# EAGLE design Esquema elètric (EAGLE 7.4.0)
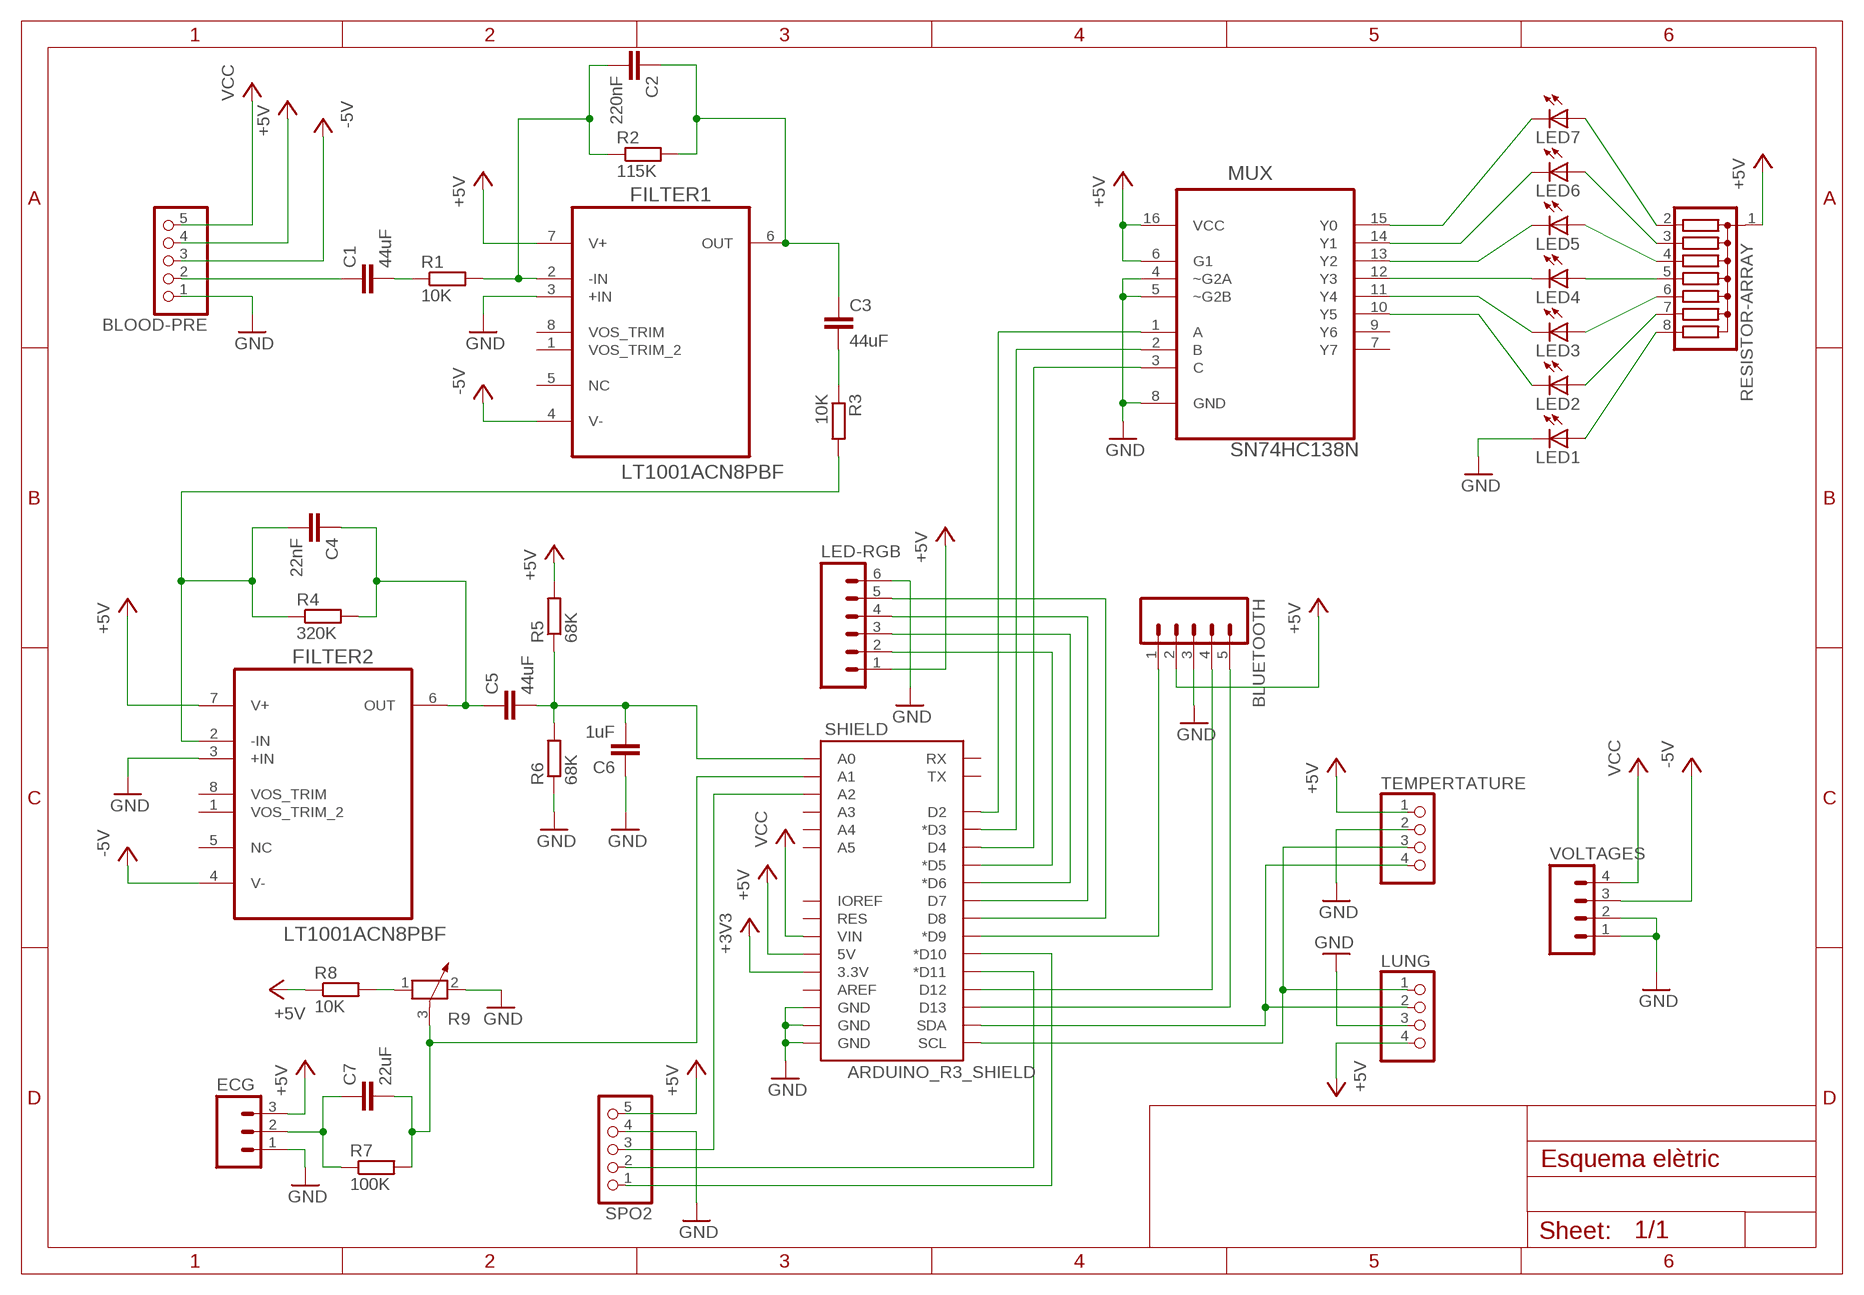
[diagram p0: schematic, sheet 1]

## Parts
BLOOD-PRE  PINHD-1X5  [1X05]
BLUETOOTH  M05PTH  [1X05]
C1  44uF  C-EU050-050X075  [C050-050X075]
C2  220nF  C-EU050-024X044  [C050-024X044]
C3  44uF  C-EU050-050X075  [C050-050X075]
C4  22nF  C-EU050-024X044  [C050-024X044]
C5  44uF  C-EU050-050X075  [C050-050X075]
C6  1uF  C-EU050-050X075  [C050-050X075]
C7  22uF  C-EU050-050X075  [C050-050X075]
ECG  M03PTH  [1X03]
FILTER1  LT1001ACN8PBF  [DIP254P762X393-8]
FILTER2  LT1001ACN8PBF  [DIP254P762X393-8]
LED1  LED5MM  [LED5MM]
LED2  LED5MM  [LED5MM]
LED3  LED5MM  [LED5MM]
LED4  LED5MM  [LED5MM]
LED5  LED5MM  [LED5MM]
LED6  LED5MM  [LED5MM]
LED7  LED5MM  [LED5MM]
LED-RGB  M06SILK_FEMALE_PTH  [1X06]
LUNG  PINHD-1X4  [1X04]
MUX  SN74HC138N  [DIP254P762X508-16]
R1  10K  R0204/7  [0204/7]
R2  115K  R0204/7  [0204/7]
R3  10K  R0204/7  [0204/7]
R4  320K  R0204/7  [0204/7]
R5  68K  R0204/7  [0204/7]
R6  68K  R0204/7  [0204/7]
R7  100K  R0204/7  [0204/7]
R8  10K  R0204/7  [0204/7]
R9  POTENTIOMETER_PT-10  [PT-10]
RESISTOR-ARRAY  G07R  [SIL8]
SHIELD  ARDUINO_R3_SHIELD  [UNO_R3_SHIELD]
SPO2  PINHD-1X5  [1X05]
TEMPERTATURE  PINHD-1X4  [1X04]
VOLTAGES  M04JST  [1X04-1.5MM_JST]

## Nets
+3V3: SHIELD.3.3V
+5V [supply]: BLOOD-PRE.4 BLUETOOTH.2 ECG.3 FILTER1.7(V+) FILTER2.7(V+) LED-RGB.1 LUNG.4 MUX.6(G1) MUX.16(VCC) R5.2 R8.1 RESISTOR-ARRAY.1 SHIELD.5V SPO2.5 TEMPERTATURE.1
-5V: BLOOD-PRE.3 FILTER1.4(V-) FILTER2.4(V-) VOLTAGES.3
GND: BLOOD-PRE.1 BLUETOOTH.3 C6.1 ECG.1 FILTER1.3(+IN) FILTER2.3(+IN) LED1.K(C) LED-RGB.6 LUNG.3 MUX.4(~G2A) MUX.5(~G2B) MUX.8(GND) R6.1 R9.2 SHIELD.GND@0(GND) SHIELD.GND@1(GND) SHIELD.GND@2(GND) SPO2.4 TEMPERTATURE.2 VOLTAGES.1 VOLTAGES.2
N$1: LED7.K(C) MUX.15(Y0)
N$2: BLOOD-PRE.2 C1.1
N$3: LED6.K(C) MUX.14(Y1)
N$4: LED-RGB.2 SHIELD.D5(*D5)
N$5: LED5.K(C) MUX.13(Y2)
N$6: LED3.K(C) MUX.11(Y4)
N$7: BLUETOOTH.4 SHIELD.D12
N$8: LUNG.2 SHIELD.SDA TEMPERTATURE.4
N$9: MUX.1(A) SHIELD.D2
N$10: LED4.K(C) MUX.12(Y3)
N$11: LED2.K(C) MUX.10(Y5)
N$12: LED7.A RESISTOR-ARRAY.2
N$13: C7.1 ECG.2 R7.1
N$14: LED6.A RESISTOR-ARRAY.3
N$15: BLUETOOTH.5 SHIELD.D13
N$16: LED-RGB.5 SHIELD.D8
N$17: LED5.A RESISTOR-ARRAY.4
N$18: LED4.A RESISTOR-ARRAY.5
N$19: C7.2 R7.2 R9.3 SHIELD.A1
N$20: LED3.A RESISTOR-ARRAY.6
N$21: LED2.A RESISTOR-ARRAY.7
N$22: LED1.A RESISTOR-ARRAY.8
N$23: C4.1 C5.1 FILTER2.6(OUT) R4.2
N$24: BLUETOOTH.1 SHIELD.D9(*D9)
N$25: LED-RGB.4 SHIELD.D7
N$26: R8.2 R9.1
N$27: MUX.2(B) SHIELD.D3(*D3)
N$28: MUX.3(C) SHIELD.D4
N$29: C4.2 FILTER2.2(-IN) R3.2 R4.1
N$30: C2.1 C3.1 FILTER1.6(OUT) R2.2
N$31: C3.2 R3.1
N$32: C2.2 FILTER1.2(-IN) R1.2 R2.1
N$33: C1.2 R1.1
N$34: C5.2 C6.2 R5.1 R6.2 SHIELD.A0
N$36: LUNG.1 SHIELD.SCL TEMPERTATURE.3
N$37: SHIELD.A2 SPO2.3
N$38: SHIELD.D11(*D11) SPO2.2
N$40: LED-RGB.3 SHIELD.D6(*D6)
N$41: SHIELD.D10(*D10) SPO2.1
VCC [supply]: BLOOD-PRE.5 SHIELD.VIN VOLTAGES.4
Unconnected: FILTER1.1(VOS_TRIM_2) FILTER1.5(NC) FILTER1.8(VOS_TRIM) FILTER2.1(VOS_TRIM_2) FILTER2.5(NC) FILTER2.8(VOS_TRIM) MUX.7(Y7) MUX.9(Y6) SHIELD.A3 SHIELD.A4 SHIELD.A5 SHIELD.AREF SHIELD.IOREF SHIELD.RES SHIELD.RX SHIELD.TX

## Library data of the parts
BLOOD-PRE SPO2 = pinhead:PINHD-1X5: PIN HEADER
BLUETOOTH = SparkFun-Connectors:M05: Header 5 Standard 5-pin 0.1" header. Use with straight break away headers (SKU : PRT-00116), right angle break away headers (PRT-00553), swiss pins (PRT-00743), machine pins (PRT-00117), and female headers (PRT-00115). Molex polarized connector foot print use with SKU : PRT-08230 with associated crimp pins and housings.
C1-C7 = rcl:C-EU: CAPACITOR, European symbol
ECG = SparkFun-Connectors:M03: Header 3 Standard 3-pin 0.1" header. Use with straight break away headers (SKU : PRT-00116), right angle break away headers (PRT-00553), swiss pins (PRT-00743), machine pins (PRT-00117), and female headers (PRT-00115). Molex polarized connector foot print use with SKU : PRT-08232 with associated crimp pins and housings.
FILTER1 FILTER2 = LTC_By_element14_Batch_1:LT1001ACN8PBF: Operational Amplifier; MPN: LT1001ACN8#PBF; OC_FARNELL: 1556419; OC_NEWARK: 57M0678; PACKAGE: PDIP; SUPPLIER: LINEAR TECHNOLOGY
LED1-LED7 = led:LED: LED OSRAM: - CHIPLED LG R971, LG N971, LY N971, LG Q971, LY Q971, LO R971, LY R971 LH N974, LH R974 LS Q976, LO Q976, LY Q976 LO Q996 - Hyper CHIPLED LW Q18S LB Q993, LB Q99A, LB R99A - SideLED LS A670, LO A670, LY A670, LG A670, LP A670 LB A673, LV A673, LT A673, LW A673 LH A674 LY A675 LS A676, LA A676, LO A676, LY A676, LW A676 LS A679, LY A679, LG A679 - Hyper Micro SIDELED® LS Y876, LA Y876, LO Y876, LY Y876 LT Y87S - SmartLED LW L88C, LW L88S LB L89C, LB L89S, LG L890 LS L89K, LO L89K, LY L89K LS L896, LA L896, LO L896, LY L896 - TOPLED LS T670, LO T670, LY T670, LG T670, LP T670 LSG T670, LSP T670, LSY T670, LOP T670, LYG T670 LG T671, LOG T671, LSG T671 LB T673, LV T673, LT T673, LW T673 LH T674 LS T676, LA T676, LO T676, LY T676, LB T676, LH T676, LSB T676, LW T676 LB T67C, LV T67C, LT T67C, LS T67K, LO T67K, LY T67K, LW E67C LS E67B, LA E67B, LO E67B, LY E67B, LB E67C, LV E67C, LT E67C LW T67C LS T679, LY T679, LG T679 LS T770, LO T770, LY T770, LG T770, LP T770 LB T773, LV T773, LT T773, LW T773 LH T774 LS E675, LA E675, LY E675, LS T675 LS T776, LA T776, LO T776, LY T776, LB T776 LHGB T686 LT T68C, LB T68C - Hyper Mini TOPLED® LB M676 - Mini TOPLED Santana® LG M470 LS M47K, LO M47K, LY M47K Source: http://www.osram.convergy.de LUXEON: - LUMILED® LXK2-PW12-R00, LXK2-PW12-S00, LXK2-PW14-U00, LXK2-PW14-V00 LXK2-PM12-R00, LXK2-PM12-S00, LXK2-PM14-U00 LXK2-PE12-Q00, LXK2-PE12-R00, LXK2-PE12-S00, LXK2-PE14-T00, LXK2-PE14-U00 LXK2-PB12-K00, LXK2-PB12-L00, LXK2-PB12-M00, LXK2-PB14-N00, LXK2-PB14-P00, LXK2-PB14-Q00 LXK2-PR12-L00, LXK2-PR12-M00, LXK2-PR14-Q00, LXK2-PR14-R00 LXK2-PD12-Q00, LXK2-PD12-R00, LXK2-PD12-S00 LXK2-PH12-R00, LXK2-PH12-S00 LXK2-PL12-P00, LXK2-PL12-Q00, LXK2-PL12-R00 Source: www.luxeon.com KINGBRIGHT: KA-3528ASYC Source: www.kingbright.com
LED-RGB = SparkFun-Connectors:M06: Header 6 Standard 6-pin 0.1" header. Use with straight break away headers (SKU : PRT-00116), right angle break away headers (PRT-00553), swiss pins (PRT-00743), machine pins (PRT-00117), and female headers (PRT-00115). Molex polarized connector foot print use with SKU : PRT-08094 with associated crimp pins and housings. NOTES ON THE VARIANTS LOCK and LOCK_LONGPADS... This footprint was designed to help hold the alignment of a through-hole component (i.e. 6-pin header) while soldering it into place. You may notice that each hole has been shifted either up or down by 0.005 of an inch from it's more standard position (which is a perfectly straight line). This slight alteration caused the pins (the squares in the middle) to touch the edges of the holes. Because they are alternating, it causes a "brace" to hold the component in place. 0.005 has proven to be the perfect amount of "off-center" position when using our standard breakaway headers. Although looks a little odd when you look at the bare footprint, once you have a header in there, the alteration is very hard to notice. Also,if you push a header all the way into place, it is covered up entirely on the bottom side. This idea of altering the position of holes to aid alignment will be further integrated into the Sparkfun Library for other footprints. It can help hold any component with 3 or more connection pins.; PROD_ID: CONN-08437
LUNG TEMPERTATURE = pinhead:PINHD-1X4: PIN HEADER
MUX = Texas Instruments_By_element14_Batch_1:SN74HC138N: 3 line to 8-line decoders demultiplexers; MPN: SN74HC138N; OC_FARNELL: 9591087; OC_NEWARK: 60K6824; PACKAGE: PDIP-16; SUPPLIER: Texas Instruments
R1-R8 = eagle-ltspice:R: RESISTOR, European symbol; SPICEMODEL: NONE; SPICEPREFIX: R
R9 = rcl:POTENTIOMETER_: Potentiometer
RESISTOR-ARRAY = resistor-sil:G07R: SIL RESISTOR; OC_FARNELL: unknown; OC_NEWARK: unknown
SHIELD = SparkFun-Boards:ARDUINO_R3_SHIELD: Shield form compatible with the Arduino Uno R3.
VOLTAGES = SparkFun-Connectors:M04: Header 4 Standard 4-pin 0.1" header. Use with straight break away headers (SKU : PRT-00116), right angle break away headers (PRT-00553), swiss pins (PRT-00743), machine pins (PRT-00117), and female headers (PRT-00115). Molex polarized connector foot print use with SKU : PRT-08231 with associated crimp pins and housings. 1MM SMD Version SKU: PRT-10208

## Net classes
1 supply: width 0.787 mm

## Board
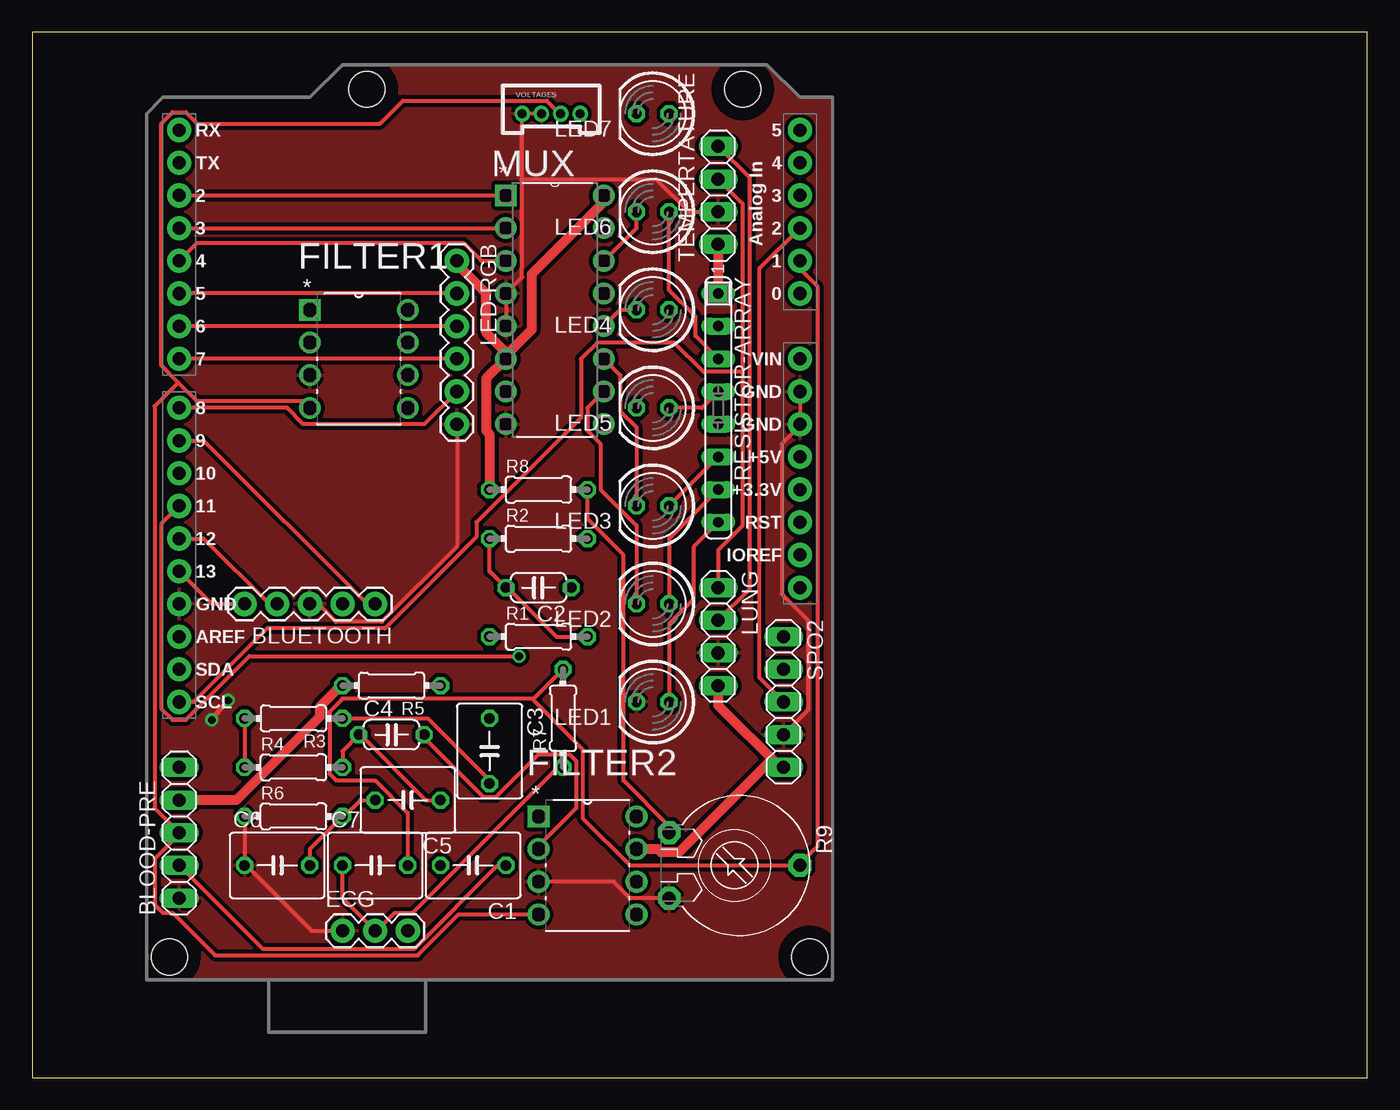
[diagram p1: board, top side]
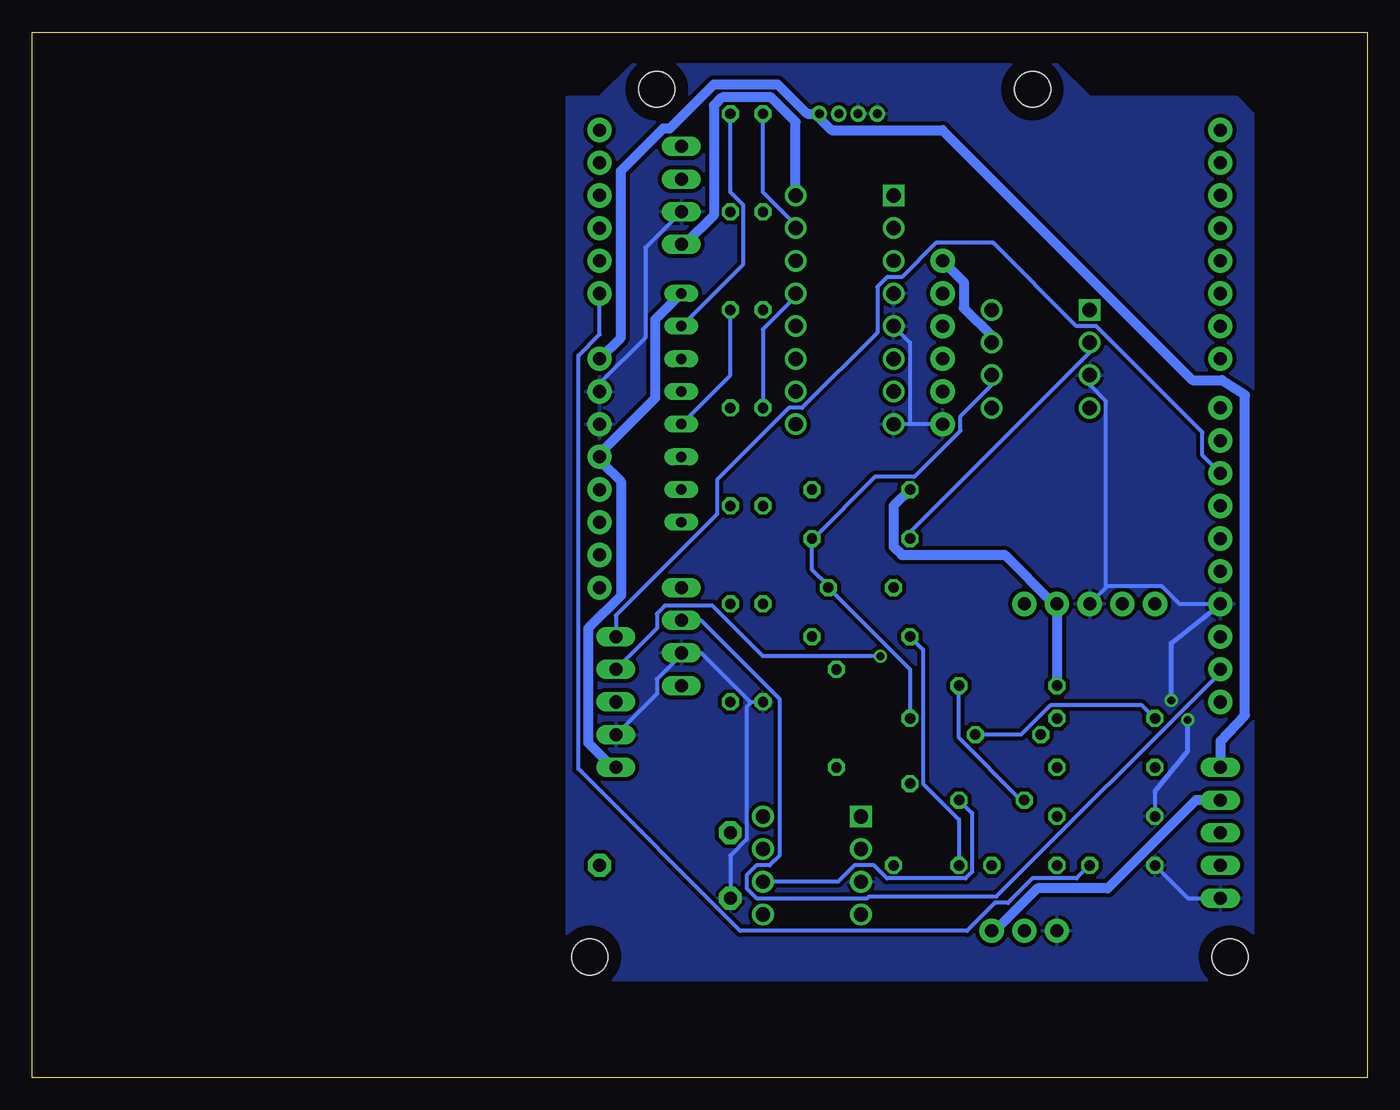
[diagram p2: board, bottom side, seen from below]

Size 103.81 x 81.27 mm. Coordinates in mm from the lower left corner, seen from the top.
Outline: 0,0 103.81,0 103.81,81.27 0,81.27 0,0
Copper layers (1*16): Top 0.035mm / dielectric 1.5mm / Bottom 0.035mm
Design rules "default *": minimum track width 12mil, minimum drill 24mil, track to track 8mil, track to pad 8mil, pad to pad 8mil, via to via 8mil, smd to smd 8mil, copper to edge 40mil, drill to drill 8mil, minimum pad ring 10mil, minimum via ring 8mil, stop-mask expansion 4mil, vias tented up to drill 0mil, thermal gap 10mil
Holes 2.8 mm at 55.24,76.83 60.45,9.4 10.67,9.4 26.04,76.83

### Footprints (pad centres in the part's own frame; a part is rotated, then mirrored left to right if it is on the bottom)
1X05 = drill 1.016 long: 1 -5.08,0; 2 -2.54,0; 3 0,0; 4 2.54,0; 5 5.08,0
1X05' = drill 1.016 pad 1.88: 1 0,0; 2 2.54,0; 3 5.08,0; 4 7.62,0; 5 10.16,0
C050-050X075 = drill 0.813 octagon: 1 -2.54,0; 2 2.54,0
C050-024X044 = drill 0.813 octagon: 1 -2.54,0; 2 2.54,0
1X03 = drill 1.016 pad 1.88: 1 0,0; 2 2.54,0; 3 5.08,0
DIP254P762X393-8 = drill 1.118 square: 1 -7.62,7.62 | drill 1.118: 2 -7.62,5.08; 3 -7.62,2.54; 4 -7.62,0; 5 0,0; 6 0,2.54; 7 0,5.08; 8 0,7.62
LED5MM = drill 0.813 octagon: A -1.27,0; K 1.27,0
1X06 = drill 1.016 pad 1.88: 1 0,0; 2 2.54,0; 3 5.08,0; 4 7.62,0; 5 10.16,0; 6 12.7,0
1X04 = drill 1.016 long: 1 -3.81,0; 2 -1.27,0; 3 1.27,0; 4 3.81,0
DIP254P762X508-16 = drill 1.118 square: 1 -7.62,17.78 | drill 1.118: 2 -7.62,15.24; 3 -7.62,12.7; 4 -7.62,10.16; 5 -7.62,7.62; 6 -7.62,5.08; 7 -7.62,2.54; 8 -7.62,0; 9 0,0; 10 0,2.54; 11 0,5.08; 12 0,7.62; 13 0,10.16; 14 0,12.7; 15 0,15.24; 16 0,17.78
0204/7 = drill 0.813 octagon: 1 -3.81,0; 2 3.81,0
PT-10 = drill 1.016 pad 1.778 octagon: 1 -2.54,-5.08; 2 2.54,-5.08; 3 0,5.08
SIL8 = drill 0.813 long: 1 -8.89,0; 2 -6.35,0; 3 -3.81,0; 4 -1.27,0; 5 1.27,0; 6 3.81,0; 7 6.35,0; 8 8.89,0
UNO_R3_SHIELD = drill 1.016 pad 1.88: 3.3V 50.8,26.67; 5V 50.8,29.21; A0 50.8,41.91; A1 50.8,44.45; A2 50.8,46.99; A3 50.8,49.53; A4 50.8,52.07; A5 50.8,54.61; AREF 2.54,15.24; D2 2.54,49.53; D3 2.54,46.99; D4 2.54,44.45; D5 2.54,41.91; D6 2.54,39.37; D7 2.54,36.83; D8 2.54,33.02; D9 2.54,30.48; D10 2.54,27.94; D11 2.54,25.4; D12 2.54,22.86; D13 2.54,20.32; GND@0 50.8,31.75; GND@1 50.8,34.29; GND@2 2.54,17.78; IOREF 50.8,21.59; NC 50.8,19.05; RES 50.8,24.13; RX 2.54,54.61; SCL 2.54,10.16; SDA 2.54,12.7; TX 2.54,52.07; VIN 50.8,36.83
1X04-1.5MM_JST = drill 0.7: 1 0,0; 2 1.5,0; 3 3,0; 4 4.5,0

### Placement (x,y rotation side)
BLOOD-PRE  11.43,19.05 90 top
BLUETOOTH  [1X05']  26.67,36.83 180 top
C1  34.29,16.51 180 top
C2  39.37,38.1 180 top
C3  35.56,25.4 270 top
C4  27.94,26.67 0 top
C5  29.21,21.59 180 top
C6  19.05,16.51 0 top
C7  26.67,16.51 0 top
ECG  24.13,11.43 0 top
FILTER1  29.21,52.07 0 top
FILTER2  46.99,12.7 0 top
LED1  48.26,29.21 180 top
LED2  48.26,36.83 180 top
LED3  48.26,44.45 180 top
LED4  48.26,59.69 180 top
LED5  48.26,52.07 180 top
LED6  48.26,67.31 180 top
LED7  48.26,74.93 180 top
LED-RGB  33.02,63.5 270 top
LUNG  53.34,34.29 270 top
MUX  44.45,50.8 0 top
R1  39.37,34.29 0 top
R2  39.37,41.91 0 top
R3  20.32,27.94 180 top
R4  20.32,24.13 0 top
R5  27.94,30.48 180 top
R6  20.32,20.32 0 top
R7  41.27,27.94 90 top
R8  39.37,45.72 0 top
R9  54.61,16.51 270 top
RESISTOR-ARRAY  53.34,52.07 270 top
SHIELD  8.89,19.05 0 top
SPO2  58.42,29.21 270 top
TEMPERTATURE  53.34,68.58 90 top
VOLTAGES  38.1,74.93 0 top

### Tracks (layer width: path | path; a pad name or v marks a point on that pad's centre or on a via)
+5V
  Top 0.787: BLOOD-PRE.4 15.88,21.59 22.35,28.07 22.35,28.83 24,30.48 R5.2 | LUNG.4 53.34,28.96 58.17,24.13 SPO2.5 57.28,24.51 50.29,17.53 48.9,17.53 48.64,17.78 FILTER2.7 | TEMPERTATURE.1 RESISTOR-ARRAY.1 | R8.1 35.56,50.04 35.31,50.29 35.31,54.36 MUX.6 | MUX.16 44.45,68.07 38.86,62.48 38.86,58.17 36.96,56.26 MUX.6 | LED-RGB.1 33.02,63.25 35.31,60.96 35.31,57.91 36.7,56.52 MUX.6
  Bottom 0.787: R5.2 BLUETOOTH.2 24.51,36.96 28.19,40.64 36.2,40.64 36.83,41.27 36.83,44.45 R8.1 | ECG.3 28.96,11.43 25.65,14.73 20.19,14.73 13.34,21.59 BLOOD-PRE.4 | RESISTOR-ARRAY.1 55.37,58.93 55.37,52.83 59.69,48.51 SHIELD.5V 59.56,47.88 58.04,46.35 58.04,37.47 60.58,34.92 60.58,26.04 58.67,24.13 SPO2.5 | FILTER1.7 29.21,57.66 31.37,59.82 31.37,61.85 LED-RGB.1 | TEMPERTATURE.1 53.09,64.77 50.8,67.06 50.8,75.56 50.16,76.2 46.35,76.2 44.45,74.3 MUX.16
-5V
  Top 0.305: 11.37,54.04 12.83,52.58 21.08,52.58 FILTER1.4 | 11.37,54.04 10.03,55.37 10.03,74.17 10.92,75.06 11.94,75.06 12.83,74.17 27.05,74.17 28.83,75.95 40.01,75.95 41.02,74.93 VOLTAGES.3 | 11.37,54.04 9.53,52.2 9.53,20.95 BLOOD-PRE.3 11.43,18.92 9.53,17.02 9.53,13.46 10.16,12.83 10.92,12.83 14.22,9.53 29.97,9.53 33.15,12.7 FILTER2.4
GND  (via drill 0.6)
  Top 0.305: R6.1 C6.1 16.64,16.51 21.72,11.43 ECG.1 | FILTER2.3 45.21,15.24 46.48,13.97 R9.2 | SHIELD.GND@1 SHIELD.GND@0 59.69,50.67 58.29,49.28 58.29,37.59 60.33,35.56 60.33,28.57 SPO2.4 | VOLTAGES.2 VOLTAGES.1 38.1,69.85 | 38.1,69.85 38.1,62.23 MUX.4 MUX.5 | TEMPERTATURE.2 51.05,67.31 48.51,69.85 38.1,69.85 | BLUETOOTH.3 22.23,36.83 23.62,35.43 27.18,35.43 33.02,41.27 LED-RGB.6
  Top 0.406: v13.97,27.81 v15.24,29.34
  Bottom 0.305: BLOOD-PRE.1 13.97,13.97 C6.1 | FILTER1.3 21.59,53.85 20.32,52.58 20.32,38.23 | 20.32,38.23 20.32,38.1 BLUETOOTH.3 | 20.32,38.23 16,38.23 14.61,36.83 SHIELD.GND@2 11.43,36.7 | 16.51,22.23 R6.1 | 48.01,29.21 LED1.K | 48.01,29.21 51.82,33.02 LUNG.3 53.34,32.89 55.24,30.99 55.24,29.84 SPO2.4 | R9.2 49.53,17.27 48.26,18.54 48.26,28.83 48.01,29.08 48.01,29.21 | LED-RGB.6 35.56,50.8 | 35.56,50.8 MUX.8 | SHIELD.GND@1 59.69,53.98 56.13,57.53 56.13,64.52 TEMPERTATURE.2 | 35.56,50.8 35.56,57.15 MUX.5
  Bottom 0.406: 16.51,22.23 13.97,25.4 v13.97,27.81 | v15.24,29.34 15.24,33.78 12.83,35.69 SHIELD.GND@2
  pour Top (isolate 0.305): 8.89,74.93 8.89,7.62 62.23,7.62 62.23,76.2 59.69,76.2 57.15,78.74 24.13,78.74 21.59,76.2 10.16,76.2
  pour Bottom (isolate 0.305): 8.89,74.93 8.89,7.62 62.23,7.62 62.23,76.2 59.69,76.2 57.15,78.74 24.13,78.74 21.59,76.2 10.16,76.2
N$1
  Bottom 0.305: LED7.K 46.99,68.83 44.45,66.29 MUX.15
N$2
  Top 0.305: C1.1 36.2,16.51 29.72,10.03 17.91,10.03 BLOOD-PRE.2
N$3
  Top 0.305: LED6.K 46.99,66.04 MUX.14
N$4
  Top 0.305: LED-RGB.2 SHIELD.D5
N$5
  Bottom 0.305: LED5.K 46.99,58.17 44.45,60.71 MUX.13
N$6
  Top 0.305: LED3.K 46.99,50.55 45.72,51.82 45.72,54.61 MUX.11
N$7
  Top 0.305: BLUETOOTH.4 18.41,36.83 13.34,41.91 SHIELD.D12
N$8
  Top 0.305: LUNG.2 55.75,37.97 55.75,69.98 TEMPERTATURE.4
  Bottom 0.305: SHIELD.SDA 11.43,31.5 28.83,14.1 38.73,14.1 38.86,13.97 47.5,13.97 48.26,14.73 48.26,15.75 47.5,16.51 46.48,16.51 45.72,17.27 45.72,29.46 51.82,35.56 LUNG.2
N$9
  Top 0.305: SHIELD.D2 MUX.1
N$10
  Top 0.305: LED4.K 45.72,59.69 MUX.12
N$11
  Top 0.305: LED2.K 46.99,42.93 44.2,45.72 44.2,49.28 43.18,50.29 43.18,52.07 MUX.10
N$12
  Bottom 0.305: LED7.A 49.53,68.83 48.51,67.82 48.51,63.25 RESISTOR-ARRAY.2
N$13
  Top 0.305: C7.1 24.13,13.97 ECG.2 26.8,11.43 28.19,12.83 29.59,12.83 40.89,24.13 R7.1
N$14
  Top 0.305: LED6.A 49.53,61.21 51.56,59.18 51.56,57.66 RESISTOR-ARRAY.3
N$15
  Top 0.305: BLUETOOTH.5 13.97,36.83 SHIELD.D13
N$16
  Top 0.305: SHIELD.D8 19.81,52.07 21.08,50.8 30.48,50.8 LED-RGB.5
N$17
  Top 0.305: LED5.A 52.07,52.07 RESISTOR-ARRAY.4
N$18
  Bottom 0.305: LED4.A 49.53,54.61 RESISTOR-ARRAY.5
N$19
  Top 0.305: C7.2 29.21,20.57 26.67,23.11 23.62,23.11 23.11,23.62 23.11,28.45 24.13,29.46 38.99,29.46 | R7.2 38.99,29.46 | 38.99,29.46 38.99,29.34 42.8,25.53 42.8,20.19 46.48,16.51 R9.3 59.69,16.64 61.09,18.03 61.09,61.47 59.69,62.87 SHIELD.A1
N$20
  Top 0.305: RESISTOR-ARRAY.6 LED3.A
N$21
  Top 0.305: LED2.A 49.53,41.91 RESISTOR-ARRAY.7
N$22
  Top 0.305: LED1.A 49.53,35.31 51.44,37.21 51.44,41.27 RESISTOR-ARRAY.8
N$23
  Top 0.305: R4.2 24.13,25.4 C4.1 25.53,26.67 30.61,21.59 C5.1
  Bottom 0.305: FILTER2.6 41.15,15.24 39.88,16.51 38.35,16.51 37.34,15.49 31.24,15.49 30.73,16 30.73,20.57 C5.1
N$24
  Top 0.305: BLUETOOTH.1 26.04,36.83 13.34,49.53 SHIELD.D9
N$25
  Top 0.305: LED-RGB.4 SHIELD.D7
N$26
  Top 0.305: R8.2 43.18,43.43 45.97,40.64 45.97,23.11 49.53,19.56 R9.1
N$27
  Top 0.305: SHIELD.D3 MUX.2
N$28
  Top 0.305: MUX.3 34.92,63.5 33.53,64.9 12.83,64.9 SHIELD.D4
N$29
  Top 0.305: R3.2 R4.1 | FILTER2.2 39.37,18.03 42.29,20.95 42.29,24.64 41.78,25.15 39.37,25.15 36.07,21.84 35.05,21.84 30.48,26.42 C4.2
  Bottom 0.305: C4.2 26.92,26.67 24.64,28.96 17.53,28.96 R3.2
N$30
  Bottom 0.305: C3.1 35.56,31.75 C2.1 41.91,38.23 43.18,39.5 R2.2 43.05,41.91 38.23,46.74 35.18,46.74 31.62,50.29 31.62,51.44 29.21,53.85 FILTER1.6
N$31
  Top 0.305: C3.2 35.56,23.11 30.73,27.94 R3.1
N$32
  Top 0.305: R2.1 35.56,39.37 C2.2 36.96,38.1 40.77,34.29 R1.2
  Bottom 0.305: FILTER1.2 21.59,56.39 35.56,42.42 R2.1
N$33
  Bottom 0.305: C1.2 31.75,20.07 34.54,22.86 34.54,33.27 R1.1
N$34
  Top 0.305: C6.2 21.59,17.78 R6.2 24.26,20.32 25.53,21.59 C5.2
  Bottom 0.305: R5.1 31.75,26.42 26.92,21.59 C5.2 | SHIELD.A0 59.69,57.78 61.34,56.13 61.34,24 48.77,11.43 31.11,11.43 28.96,13.59 27.94,13.59 26.04,15.49 22.61,15.49 C6.2
N$36
  Top 0.305: LUNG.1 53.34,41.02 55.24,42.93 55.24,54.86 | 55.24,54.86 55.24,67.94 TEMPERTATURE.3 | SHIELD.SCL 12.57,29.21 18.29,34.92 27.43,34.92 34.54,42.04 34.54,43.18 42.67,51.31 42.67,55.88 43.94,57.15 49.91,57.15 52.2,54.86 55.24,54.86
N$37
  Top 0.305: SPO2.3 56.52,31.11 56.52,62.87 SHIELD.A2
N$38  (via drill 0.61)
  Top 0.305: v37.85,32.77 16.89,32.77 11.94,27.81 10.92,27.81 10.03,28.7 10.03,43.05 SHIELD.D11
  Bottom 0.305: SPO2.2 55.24,34.92 55.24,36.07 54.61,36.7 50.93,36.7 46.99,32.77 v37.85,32.77
N$40
  Top 0.305: LED-RGB.3 SHIELD.D6
N$41
  Bottom 0.305: SPO2.1 58.42,35.94 50.55,43.81 50.55,46.48 44.96,52.07 43.94,52.07 38.1,57.91 38.1,61.47 37.34,62.23 36.2,62.23 33.53,64.9 29.08,64.9 22.61,58.42 21.08,58.42 12.83,50.16 12.83,48.39 SHIELD.D10
VCC
  Bottom 0.787: SHIELD.VIN 58.04,57.53 58.04,70.48 54.74,73.79 54.23,73.79 50.8,77.22 45.85,77.22 43.56,74.93 VOLTAGES.4 42.55,74.55 41.66,73.66 33.02,73.66 13.59,54.23 11.3,54.23 9.53,53.09 9.53,28.19 11.43,26.16 BLOOD-PRE.5